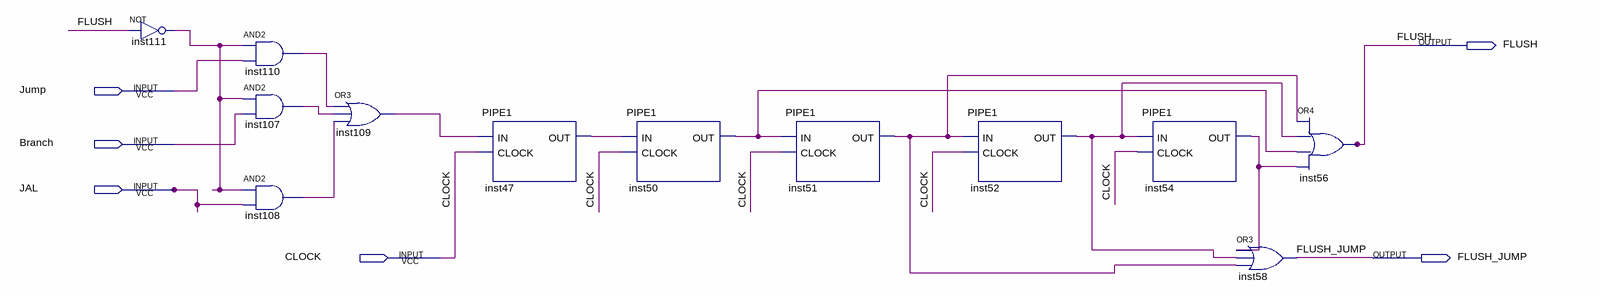
[diagram p0: schematic sheet]
// Quartus schematic FLUSH_UNIT.bdf as structural Verilog: 12 symbols, 6 pins
module FLUSH_UNIT (
  input  Jump,
  input  Branch,
  input  JAL,
  input  CLOCK,
  output FLUSH,
  output FLUSH_JUMP
);

  wire inst47_out, inst50_out, inst51_out, inst52_out, inst54_out, inst107_out, inst108_out, inst109_out,
       inst110_out, inst111_out;

  not inst111 (inst111_out, FLUSH);
  and inst110 (inst110_out, inst111_out, Jump);
  and inst107 (inst107_out, inst111_out, Branch);
  and inst108 (inst108_out, inst111_out, JAL);
  or inst109 (inst109_out, inst110_out, inst107_out, inst108_out);
  PIPE1 inst47 (.IN(inst109_out), .CLOCK(CLOCK), .OUT(inst47_out));
  PIPE1 inst50 (.IN(inst47_out), .CLOCK(CLOCK), .OUT(inst50_out));
  PIPE1 inst51 (.IN(inst50_out), .CLOCK(CLOCK), .OUT(inst51_out));
  PIPE1 inst52 (.IN(inst51_out), .CLOCK(CLOCK), .OUT(inst52_out));
  PIPE1 inst54 (.IN(inst52_out), .CLOCK(CLOCK), .OUT(inst54_out));
  or inst58 (FLUSH_JUMP, inst54_out, inst52_out, inst51_out);
  or inst56 (FLUSH, inst51_out, inst52_out, inst50_out, inst54_out);
endmodule
